# EAGLE design INFINITEAI-PCB (EAGLE 9.7.0)
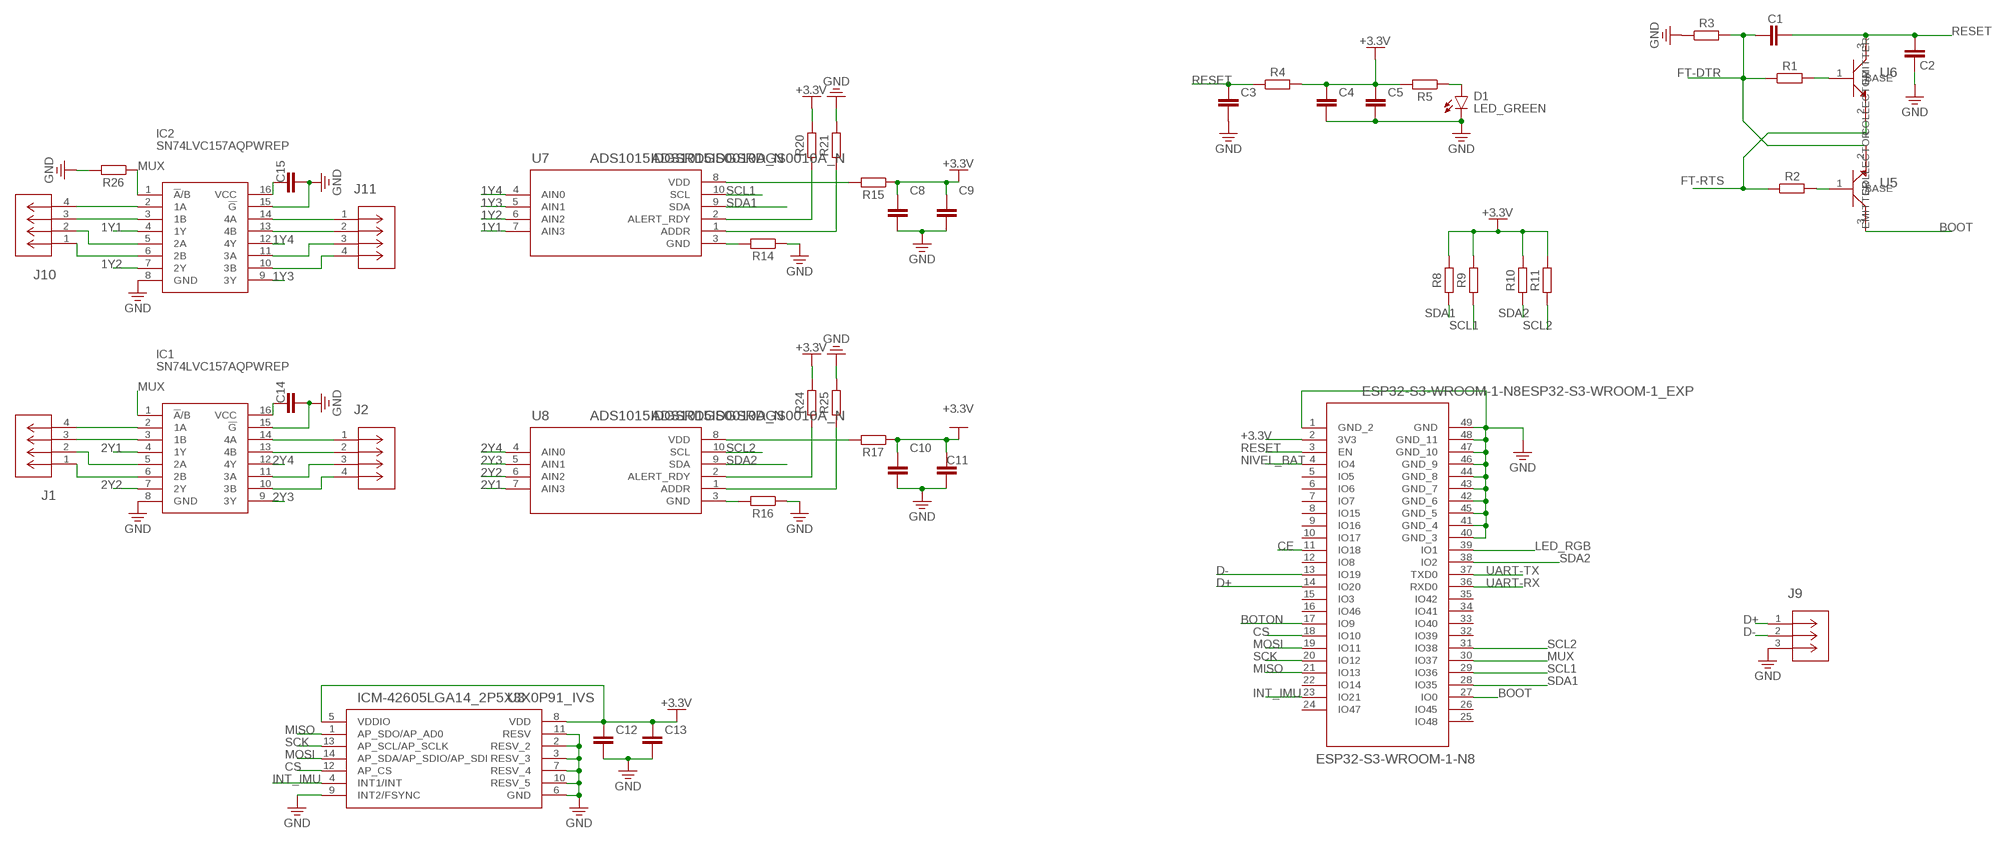
[diagram p0: schematic, sheet 1, part 1 of 2]
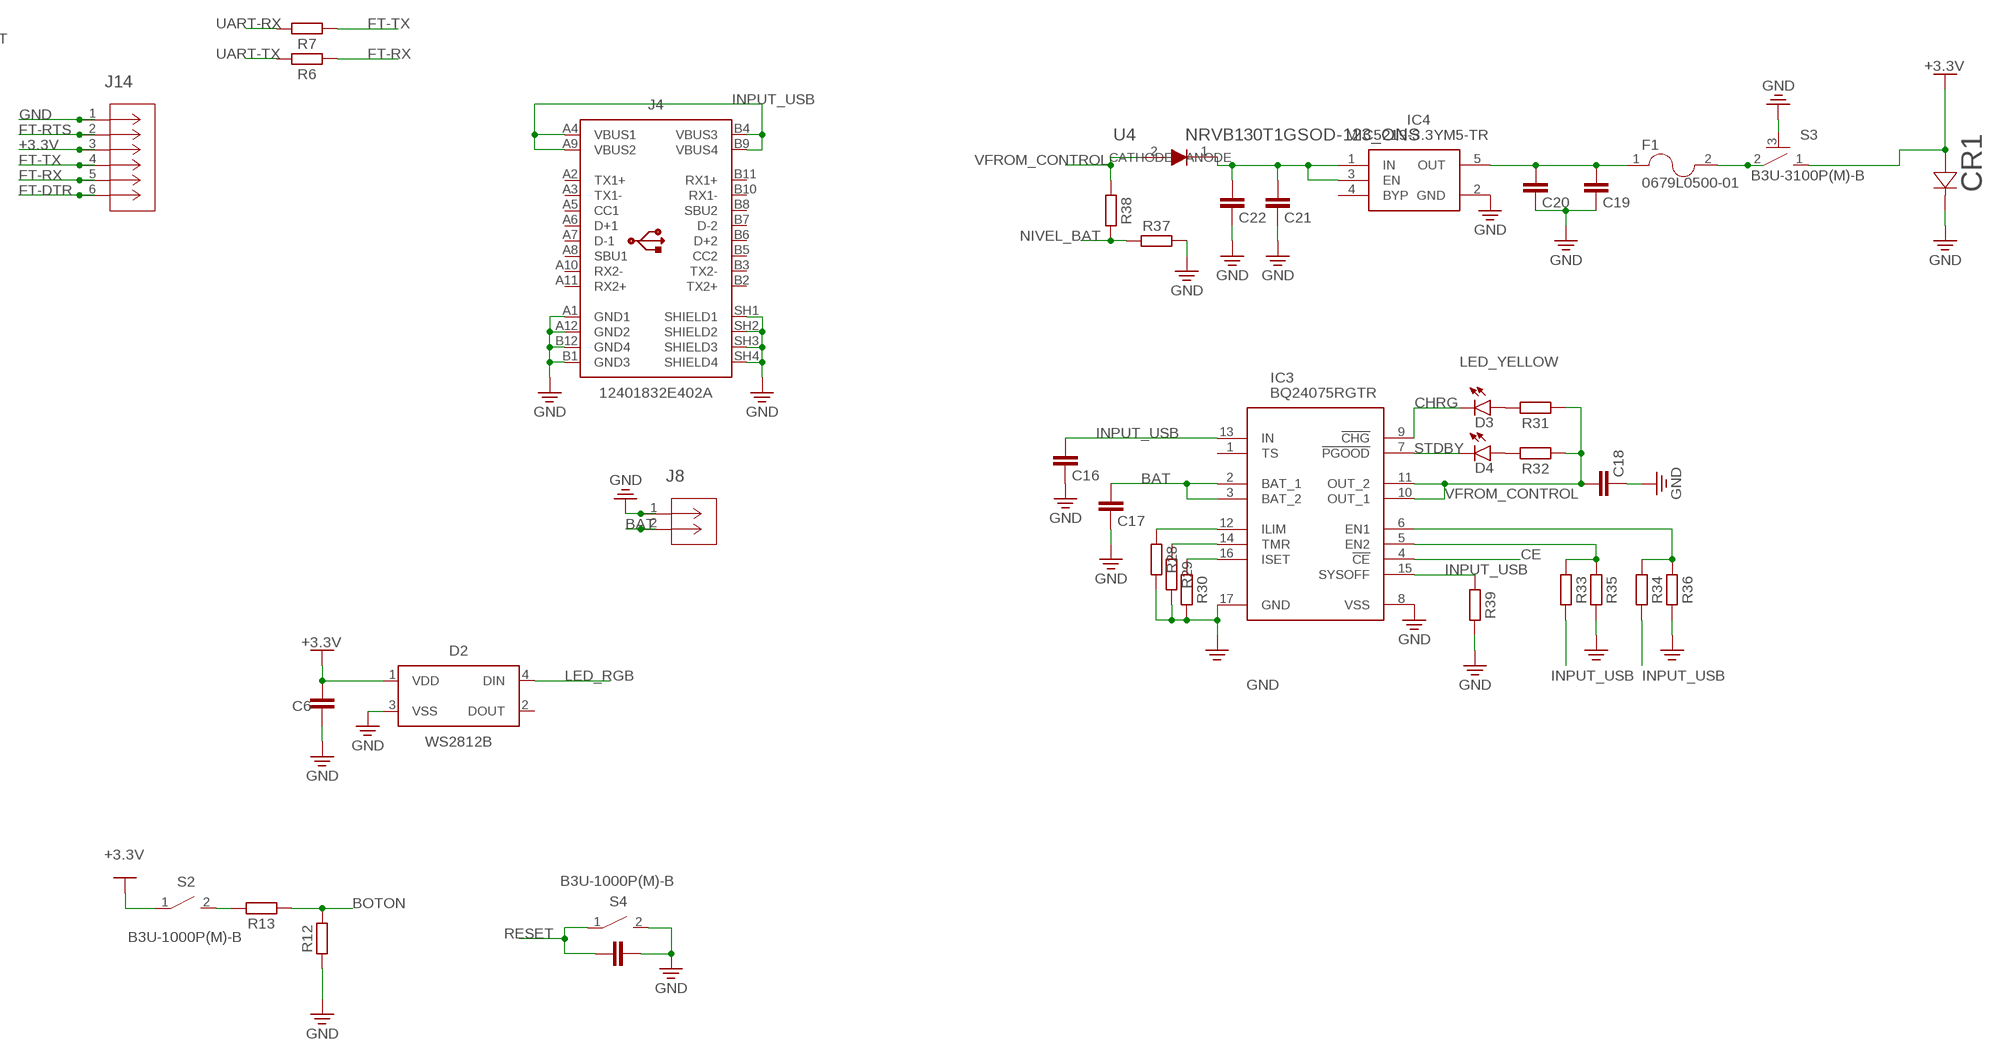
[diagram p1: schematic, sheet 1, part 2 of 2]

## Parts
C1  C_CHIP-0402(1005-METRIC)  [CAPC1005X60]
C2  C_CHIP-0402(1005-METRIC)  [CAPC1005X60]
C3  C_CHIP-0402(1005-METRIC)  [CAPC1005X60]
C4  C_CHIP-0402(1005-METRIC)  [CAPC1005X60]
C5  C_CHIP-0402(1005-METRIC)  [CAPC1005X60]
C6  C_CHIP-0402(1005-METRIC)  [CAPC1005X60]
C7  C_CHIP-0402(1005-METRIC)  [CAPC1005X60]
C8  C_CHIP-0402(1005-METRIC)  [CAPC1005X60]
C9  C_CHIP-0402(1005-METRIC)  [CAPC1005X60]
C10  C_CHIP-0402(1005-METRIC)  [CAPC1005X60]
C11  C_CHIP-0402(1005-METRIC)  [CAPC1005X60]
C12  C_CHIP-0402(1005-METRIC)  [CAPC1005X60]
C13  C_CHIP-0402(1005-METRIC)  [CAPC1005X60]
C14  C_CHIP-0402(1005-METRIC)  [CAPC1005X60]
C15  C_CHIP-0402(1005-METRIC)  [CAPC1005X60]
C16  C_CHIP-0402(1005-METRIC)  [CAPC1005X60]
C17  C_CHIP-0402(1005-METRIC)  [CAPC1005X60]
C18  C_CHIP-0402(1005-METRIC)  [CAPC1005X60]
C19  C_CHIP-0402(1005-METRIC)  [CAPC1005X60]
C20  C_CHIP-0402(1005-METRIC)  [CAPC1005X60]
C21  C_CHIP-0402(1005-METRIC)  [CAPC1005X60]
C22  C_CHIP-0402(1005-METRIC)  [CAPC1005X60]
CR1  BZT52C3V3-13SOD123_DIO  [SOD123_DIO]
D1  LED_GREEN  CHIP-FLAT-G_0402  [LEDC1005X25N_FLAT-G]
D2  WS2812B  [WS2812B]
D3  LED_YELLOW  CHIP-FLAT-Y_0402  [LEDC1005X25N_FLAT-Y]
D4  LED_YELLOW  CHIP-FLAT-Y_0402  [LEDC1005X25N_FLAT-Y]
ESP32-S3-WROOM-1-N8  ESP32-S3-WROOM-1-N8ESP32-S3-WROOM-1_EXP  [ESP32-S3-WROOM-1_EXP]
F1  0679L0500-01  [FUSC6125X279N]
IC1  SN74LVC157AQPWREP  [SOP65P640X120-16N]
IC2  SN74LVC157AQPWREP  [SOP65P640X120-16N]
IC3  BQ24075RGTR  [QFN50P300X300X100-17N]
IC4  MIC5219-3.3YM5-TR  [SOT95P280X145-5N]
J1  BM04B-SRSS-TBCONN4_BM04B-SRSS_JST  [CONN4_BM04B-SRSS_JST]
J2  BM04B-SRSS-TBCONN4_BM04B-SRSS_JST  [CONN4_BM04B-SRSS_JST]
J4  12401832E402A  [12401832E402A]
J8  B2B-ZR-SM4-TF(LF)(SN)CONN_B2B-ZR-SM4-TF_JST  [CONN_B2B-ZR-SM4-TF_JST]
J9  BM03B-SRSS-TB(LF)(SN)CONN_BM03B-SRSS-TB(LF)(SN)_JST  [CONN_BM03B-SRSS-TB(LF)(SN)_JST]
J10  BM04B-SRSS-TBCONN4_BM04B-SRSS_JST  [CONN4_BM04B-SRSS_JST]
J11  BM04B-SRSS-TBCONN4_BM04B-SRSS_JST  [CONN4_BM04B-SRSS_JST]
J14  BM06B-SRSS-TB(LF)(SN)CONN_BM06B-SRSS-TB_JST  [CONN_BM06B-SRSS-TB_JST]
R1  R_CHIP-0402(1005-METRIC)  [RESC1005X40]
R2  R_CHIP-0402(1005-METRIC)  [RESC1005X40]
R3  R_CHIP-0402(1005-METRIC)  [RESC1005X40]
R4  R_CHIP-0402(1005-METRIC)  [RESC1005X40]
R5  R_CHIP-0402(1005-METRIC)  [RESC1005X40]
R6  R_CHIP-0402(1005-METRIC)  [RESC1005X40]
R7  R_CHIP-0402(1005-METRIC)  [RESC1005X40]
R8  R_CHIP-0402(1005-METRIC)  [RESC1005X40]
R9  R_CHIP-0402(1005-METRIC)  [RESC1005X40]
R10  R_CHIP-0402(1005-METRIC)  [RESC1005X40]
R11  R_CHIP-0402(1005-METRIC)  [RESC1005X40]
R12  R_CHIP-0402(1005-METRIC)  [RESC1005X40]
R13  R_CHIP-0402(1005-METRIC)  [RESC1005X40]
R14  R_CHIP-0402(1005-METRIC)  [RESC1005X40]
R15  R_CHIP-0402(1005-METRIC)  [RESC1005X40]
R16  R_CHIP-0402(1005-METRIC)  [RESC1005X40]
R17  R_CHIP-0402(1005-METRIC)  [RESC1005X40]
R20  R_CHIP-0402(1005-METRIC)  [RESC1005X40]
R21  R_CHIP-0402(1005-METRIC)  [RESC1005X40]
R24  R_CHIP-0402(1005-METRIC)  [RESC1005X40]
R25  R_CHIP-0402(1005-METRIC)  [RESC1005X40]
R26  R_CHIP-0402(1005-METRIC)  [RESC1005X40]
R28  R_CHIP-0402(1005-METRIC)  [RESC1005X40]
R29  R_CHIP-0402(1005-METRIC)  [RESC1005X40]
R30  R_CHIP-0402(1005-METRIC)  [RESC1005X40]
R31  R_CHIP-0402(1005-METRIC)  [RESC1005X40]
R32  R_CHIP-0402(1005-METRIC)  [RESC1005X40]
R33  R_CHIP-0402(1005-METRIC)  [RESC1005X40]
R34  R_CHIP-0402(1005-METRIC)  [RESC1005X40]
R35  R_CHIP-0402(1005-METRIC)  [RESC1005X40]
R36  R_CHIP-0402(1005-METRIC)  [RESC1005X40]
R37  R_CHIP-0402(1005-METRIC)  [RESC1005X40]
R38  R_CHIP-0402(1005-METRIC)  [RESC1005X40]
R39  R_CHIP-0402(1005-METRIC)  [RESC1005X40]
S2  B3U-1000P(M)-B  B3U-X000B3U-1000P(M)-B1000P(M)-B  [B3U-1000P(M)-B]
S3  B3U-3100P(M)-B  B3U-X100B3U-3100P(M)-B3100P(M)-B  [B3U-3100P(M)-B]
S4  B3U-1000P(M)-B  B3U-X000B3U-1000P(M)-B1000P(M)-B  [B3U-1000P(M)-B]
U3  ICM-42605LGA14_2P5X3X0P91_IVS  [LGA14_2P5X3X0P91_IVS]
U4  NRVB130T1GSOD-123_ONS  [SOD-123_ONS]
U5  MMBT4401LT1GSOT-23_ONS  [SOT-23_ONS]
U6  MMBT4401LT1GSOT-23_ONS  [SOT-23_ONS]
U7  ADS1015IDGSRDGS0010A_N  [DGS0010A_N]
U8  ADS1015IDGSRDGS0010A_N  [DGS0010A_N]

## Nets
1Y1: IC2.4(1Y) U7.7(AIN3)
1Y2: IC2.7(2Y) U7.6(AIN2)
1Y3: IC2.9(3Y) U7.5(AIN1)
1Y4: IC2.12(4Y) U7.4(AIN0)
2Y1: IC1.4(1Y) U8.7(AIN3)
2Y2: IC1.7(2Y) U8.6(AIN2)
2Y3: IC1.9(3Y) U8.5(AIN1)
2Y4: IC1.12(4Y) U8.4(AIN0)
+3.3V: C4.1 C5.1 C6.1 C8.1 C9.1 C10.1 C11.1 C12.1 C13.1 CR1.2 D2.1(VDD) ESP32-S3-WROOM-1-N8.2(3V3) J14.3 R4.2 R5.2 R8.2 R9.2 R10.2 R11.2 R15.1 R17.1 R20.2 R24.2 S2.1 S3.1 U3.5(VDDIO) U3.8(VDD)
BAT: C17.1 IC3.2(BAT_1) IC3.3(BAT_2) J8.2
BOOT: ESP32-S3-WROOM-1-N8.27(IO0) U5.3(COLLECTOR)
BOTON: ESP32-S3-WROOM-1-N8.17(IO9) R12.2 R13.1
CE: ESP32-S3-WROOM-1-N8.11(IO18) IC3.4(!CE)
CHRG: D3.C IC3.9(!CHG)
CS: ESP32-S3-WROOM-1-N8.18(IO10) U3.12(AP_CS)
D+: ESP32-S3-WROOM-1-N8.14(IO20) J9.1
D-: ESP32-S3-WROOM-1-N8.13(IO19) J9.2
EN1: IC3.6(EN1) R34.1 R36.1
EN2: IC3.5(EN2) R33.1 R35.1
FT-DTR: C1.2 J14.6 R1.1 R3.2 U5.2(EMITTER)
FT-RTS: J14.2 R2.1 U6.2(EMITTER)
FT-RX: J14.5 R6.1
FT-TX: J14.4 R7.1
GND: C2.2 C3.2 C4.2 C5.2 C6.2 C7.2 C8.2 C9.2 C10.2 C11.2 C12.2 C13.2 C14.2 C15.2 C16.2 C17.2 C18.2 C19.2 C20.2 C21.2 C22.2 CR1.1 D1.C D2.3(VSS) ESP32-S3-WROOM-1-N8.1(GND_2) ESP32-S3-WROOM-1-N8.40(GND_3) ESP32-S3-WROOM-1-N8.41(GND_4) ESP32-S3-WROOM-1-N8.42(GND_6) ESP32-S3-WROOM-1-N8.43(GND_7) ESP32-S3-WROOM-1-N8.44(GND_8) ESP32-S3-WROOM-1-N8.45(GND_5) ESP32-S3-WROOM-1-N8.46(GND_9) ESP32-S3-WROOM-1-N8.47(GND_10) ESP32-S3-WROOM-1-N8.48(GND_11) ESP32-S3-WROOM-1-N8.49(GND) IC1.8(GND) IC1.15(!G) IC2.8(GND) IC2.15(!G) IC3.8(VSS) IC3.17(GND) IC4.2(GND) J4.A1(GND1) J4.A12(GND2) J4.B1(GND3) J4.B12(GND4) J4.SH1(SHIELD1) J4.SH2(SHIELD2) J4.SH3(SHIELD3) J4.SH4(SHIELD4) J8.1 J9.3 J14.1 R3.1 R12.1 R14.1 R16.1 R21.2 R25.2 R26.2 R28.2 R29.2 R30.2 R35.2 R36.2 R37.2 R39.2 S3.3 S4.2 U3.2(RESV_2) U3.3(RESV_3) U3.6(GND) U3.7(RESV_4) U3.9(INT2/FSYNC) U3.10(RESV_5) U3.11(RESV)
INPUT_USB: C16.1 IC3.13(IN) IC3.15(SYSOFF) J4.A4(VBUS1) J4.A9(VBUS2) J4.B4(VBUS3) J4.B9(VBUS4) R33.2 R34.2 R39.1
INT_IMU: ESP32-S3-WROOM-1-N8.23(IO21) U3.4(INT1/INT)
LED_RGB: D2.4(DIN) ESP32-S3-WROOM-1-N8.39(IO1)
MISO: ESP32-S3-WROOM-1-N8.21(IO13) U3.1(AP_SDO/AP_AD0)
MOSI: ESP32-S3-WROOM-1-N8.19(IO11) U3.14(AP_SDA/AP_SDIO/AP_SDI)
MUX: ESP32-S3-WROOM-1-N8.30(IO37) IC1.1(!A!/B) IC2.1(!A!/B) R26.1
N$1: R2.2 U5.1(BASE)
N$2: R1.2 U6.1(BASE)
N$3: C15.1 IC2.16(VCC)
N$4: IC2.3(1B) J10.3
N$5: D1.A R5.1
N$6: IC2.2(1A) J10.4
N$7: C21.1 C22.1 IC4.1(IN) IC4.3(EN) U4.1(CATHODE)
N$8: R13.2 S2.2
N$9: IC2.5(2A) J10.2
N$10: R20.1 U7.2(ALERT_RDY)
N$11: IC2.6(2B) J10.1
N$12: R14.2 U7.3(GND)
N$13: R15.2 U7.8(VDD)
N$14: IC2.11(3A) J11.3
N$15: IC2.14(4A) J11.1
N$16: R24.1 U8.2(ALERT_RDY)
N$17: IC2.13(4B) J11.2
N$18: R16.2 U8.3(GND)
N$19: R17.2 U8.8(VDD)
N$20: IC2.10(3B) J11.4
N$21: C19.1 C20.1 F1.1 IC4.5(OUT)
N$22: IC3.12(ILIM) R28.1
N$23: C14.1 IC1.16(VCC)
N$24: IC1.5(2A) J1.2
N$25: IC1.6(2B) J1.1
N$26: IC1.14(4A) J2.1
N$27: IC1.11(3A) J2.3
N$28: IC3.14(TMR) R29.1
N$29: IC1.3(1B) J1.3
N$30: IC1.2(1A) J1.4
N$31: IC1.13(4B) J2.2
N$32: IC1.10(3B) J2.4
N$33: IC3.16(ISET) R30.1
N$34: D3.A R31.2
N$35: D4.A R32.2
N$36: F1.2 S3.2
N$37: R21.1 U7.1(ADDR)
N$38: R25.1 U8.1(ADDR)
NIVEL_BAT: ESP32-S3-WROOM-1-N8.4(IO4) R37.1 R38.2
RESET: C1.1 C2.1 C3.1 C7.1 ESP32-S3-WROOM-1-N8.3(EN) R4.1 S4.1 U6.3(COLLECTOR)
SCK: ESP32-S3-WROOM-1-N8.20(IO12) U3.13(AP_SCL/AP_SCLK)
SCL1: ESP32-S3-WROOM-1-N8.29(IO36) R9.1 U7.10(SCL)
SCL2: ESP32-S3-WROOM-1-N8.31(IO38) R11.1 U8.10(SCL)
SDA1: ESP32-S3-WROOM-1-N8.28(IO35) R8.1 U7.9(SDA)
SDA2: ESP32-S3-WROOM-1-N8.38(IO2) R10.1 U8.9(SDA)
STDBY: D4.C IC3.7(!PGOOD)
UART-RX: ESP32-S3-WROOM-1-N8.36(RXD0) R7.2
UART-TX: ESP32-S3-WROOM-1-N8.37(TXD0) R6.2
VFROM_CONTROL: C18.1 IC3.10(OUT_1) IC3.11(OUT_2) R31.1 R32.1 R38.1 U4.2(ANODE)
Unconnected: D2.2(DOUT) ESP32-S3-WROOM-1-N8.5(IO5) ESP32-S3-WROOM-1-N8.6(IO6) ESP32-S3-WROOM-1-N8.7(IO7) ESP32-S3-WROOM-1-N8.8(IO15) ESP32-S3-WROOM-1-N8.9(IO16) ESP32-S3-WROOM-1-N8.10(IO17) ESP32-S3-WROOM-1-N8.12(IO8) ESP32-S3-WROOM-1-N8.15(IO3) ESP32-S3-WROOM-1-N8.16(IO46) ESP32-S3-WROOM-1-N8.22(IO14) ESP32-S3-WROOM-1-N8.24(IO47) ESP32-S3-WROOM-1-N8.25(IO48) ESP32-S3-WROOM-1-N8.26(IO45) ESP32-S3-WROOM-1-N8.32(IO39) ESP32-S3-WROOM-1-N8.33(IO40) ESP32-S3-WROOM-1-N8.34(IO41) ESP32-S3-WROOM-1-N8.35(IO42) IC3.1(TS) IC4.4(BYP) J4.A2(TX1+) J4.A3(TX1-) J4.A5(CC1) J4.A6(D+1) J4.A7(D-1) J4.A8(SBU1) J4.A10(RX2-) J4.A11(RX2+) J4.B2(TX2+) J4.B3(TX2-) J4.B5(CC2) J4.B6(D+2) J4.B7(D-2) J4.B8(SBU2) J4.B10(RX1-) J4.B11(RX1+)

## Library data of the parts
C1-C22 = Capacitor:C: Capacitor - Generic; CATEGORY: Capacitor
CR1 = Zener: BZT52C3V3:BZT52C3V3-13; COPYRIGHT: Copyright (C) 2024 Ultra Librarian. All rights reserved.; MANUFACTURER_PART_NUMBER: BZT52C3V3-13; MFR_NAME: Diodes Inc
D1 = LED:CHIP-FLAT-G; CATEGORY: LED; COLOR: GREEN; DESCRIPTION: CHIP LED FLAT; SUB-CATEGORY: CHIP; TYPE: FLAT_TOP
D2 = LED:WS2812B: Intelligent control LED integrated light source Datasheet; CATEGORY: LED; COLOR: RGB; DESCRIPTION: LED integrated light source; MANUFACTURER: Worldsemi; MPN: WS2812B; OPERATING_TEMP: -25 ℃ to +80℃(TJ); PART_STATUS: Active; SUB_CATEGORY: RGB
D3 D4 = LED:CHIP-FLAT-Y; CATEGORY: LED; COLOR: YELLOW; DESCRIPTION: CHIP LED FLAT; SUB-CATEGORY: CHIP; TYPE: FLAT_TOP
ESP32-S3-WROOM-1-N8 = ESP32-S3-WROOM-1-N8:ESP32-S3-WROOM-1-N8; COPYRIGHT: Copyright (C) 2024 Ultra Librarian. All rights reserved.; MANUFACTURER_PART_NUMBER: ESP32-S3-WROOM-1-N8; MFR_NAME: Espressif Systems; TYPE: Transceiver module
F1 = 0679L0500-01:0679L0500-01: 2410 SMT Fuse | Quick Acting | 250mA | Higher AC Voltage; MANUFACTURER: BELFUSE; MAXIMUM_PACKAGE_HEIGHT: 2.79mm; PARTREV: 0679H Apr2019; STANDARD: IPC-7351B
IC1 IC2 = SN74LVCXXX:SN74LVC157AQPWREP: Enhanced Product Quadruple 2-Line To 1-Line Data Selector / Multiplexer Source: Datasheet; DESCRIPTION: Enhanced Product Quadruple 2-Line To 1-Line Data Selector / Multiplexer; HEIGHT: 1.2mm; MANUFACTURER_NAME: Texas Instruments; MANUFACTURER_PART_NUMBER: SN74LVC157AQPWREP; MOUSER_PART_NUMBER: 595-N74LVC157AQPWREP; MOUSER_PRICE-STOCK: https://www.mouser.co.uk/ProductDetail/Texas-Instruments/SN74LVC157AQPWREP?qs=7reVrgTiN3aADQ%2FoXWttvw%3D%3D
IC3 = BQ24075RGTR:BQ24075RGTR: USB-Friendly Li-Ion Battery Charger and Power-Path Management IC, Vout 5.5V Source: Datasheet; DESCRIPTION: USB-Friendly Li-Ion Battery Charger and Power-Path Management IC, Vout 5.5V; HEIGHT: 1mm; MANUFACTURER_NAME: Texas Instruments; MANUFACTURER_PART_NUMBER: BQ24075RGTR; MOUSER_PART_NUMBER: 595-BQ24075RGTR; MOUSER_PRICE-STOCK: https://www.mouser.co.uk/ProductDetail/Texas-Instruments/BQ24075RGTR?qs=XGzIaZb%2FFYKTADIJv746hA%3D%3D
IC4 = MIC5219-3.3YM5-TR:MIC5219-3.3YM5-TR: LDO Regulator Pos 3.3V 0.5A Microchip MIC5219-3.3YM5-TR, LDO Voltage Regulator, 500mA, 3.3 V +/-2%, 2.5 12 Vin, 5-Pin SOT-23 Source: Datasheet; DESCRIPTION: LDO Regulator Pos 3.3V 0.5A Microchip MIC5219-3.3YM5-TR, LDO Voltage Regulator, 500mA, 3.3 V +/-2%, 2.5 12 Vin, 5-Pin SOT-23; HEIGHT: 1.45mm; MANUFACTURER_NAME: Microchip; MANUFACTURER_PART_NUMBER: MIC5219-3.3YM5-TR; MOUSER_PART_NUMBER: 998-MIC5219-3.3YM5TR; MOUSER_PRICE-STOCK: https://www.mouser.co.uk/ProductDetail/Microchip-Technology/MIC5219-3.3YM5-TR?qs=U6T8BxXiZAWojkIJMtSJlw%3D%3D
J1 J2 J10 J11 = JST4:BM04B-SRSS-TB; COPYRIGHT: Copyright (C) 2024 Ultra Librarian. All rights reserved.; MANUFACTURER_PART_NUMBER: BM04B-SRSS-TB; MFR_NAME: JST; TYPE: Headers, Male Pins
J4 = Connector_USB:12401832E402A: USB(3.1) Type-C, RCPT, 24POS, SMD-THT-R/A Datasheet <https://cdn.amphenol-icc.com/media/wysiwyg/files/documentation/datasheet/inputoutput/io_usb_type_c.pdf> Drawing <https://cdn.amphenol-icc.com/media/wysiwyg/files/drawing/c12401832e402a.pdf>; CATEGORY: Connector; CONTACTS: 24; CURRENT_RATING: 5A; DESCRIPTION: CONN RCP USB3.1 TYPEC 24P SMD RA; GENDER: Receptacle; MANUFACTURER: Amphenol ICC; MOUNT_TYPE: R/A; MPN: 12401832E402A; PART_STATUS: Active; ROHS_COMPLIANT: COMPLIANT; SUB-CATEGORY: USB; TYPE: USB-C
J8 = JST 2 BAT:B2B-ZR-SM4-TF(LF)(SN); COPYRIGHT: Copyright (C) 2024 Ultra Librarian. All rights reserved.; MANUFACTURER_PART_NUMBER: B2B-ZR-SM4-TF(LF)(SN); MFR_NAME: JST
J9 = JST 3:BM03B-SRSS-TB(LF)(SN); COPYRIGHT: Copyright (C) 2024 Ultra Librarian. All rights reserved.; MANUFACTURER_PART_NUMBER: BM03B-SRSS-TB(LF)(SN); MFR_NAME: JST
J14 = JST-6:BM06B-SRSS-TB(LF)(SN); COPYRIGHT: Copyright (C) 2024 Ultra Librarian. All rights reserved.; MANUFACTURER_PART_NUMBER: BM06B-SRSS-TB(LF)(SN); MFR_NAME: JST
R1-R17 R20 R21 R24-R26 R28-R39 = Resistor:R: Resistor Fixed - Generic; CATEGORY: Resistor; SUB-CATEGORY: Fixed
S2 S4 = Switch:B3U-X000: Ultra-small Tactile Switch Contact form : SPST-NO Datasheet; CATEGORY: SWITCH; DESCRIPTION: Ultra-small Surface-mounting Tactile Switches with High Contact Reliability; MANUFACTURER: OMRON; OPERATING_TEMPERATURE: -25°C to +70°C at 60%RH max; PART_STATUS: ACTIVE; SERIES: B3U; TYPE: Tactile
S3 = Switch:B3U-X100: Ultra-small Tactile Switch Contact form : SPST-NO Datasheet; CATEGORY: SWITCH; DESCRIPTION: Ultra-small Surface-mounting Tactile Switches with High Contact Reliability; MAUFACTURER: OMRON; OPERATING_TEMP: -25°C to +70°C at 60%RH max; PART_STATUS: ACTIVE; ROHS_COMPLIANCE: RoHS Compliant; SERIES: B3U; TYPE: Tactile
U3 = ICM42605:ICM-42605; COPYRIGHT: Copyright (C) 2024 Ultra Librarian. All rights reserved.; MANUFACTURER_PART_NUMBER: ICM-42605; MFR_NAME: InvenSense
U4 = NRVB130T1G:NRVB130T1G; COPYRIGHT: Copyright (C) 2024 Ultra Librarian. All rights reserved.; MANUFACTURER_PART_NUMBER: NRVB130T1G; MFR_NAME: onsemi
U5 U6 = SOT-23_ONS:MMBT4401LT1G; COPYRIGHT: Copyright (C) 2024 Ultra Librarian. All rights reserved.; MANUFACTURER_PART_NUMBER: MMBT4401LT1G; MFR_NAME: onsemi
U7 U8 = ADS1015:ADS1015IDGSR; COPYRIGHT: Copyright (C) 2024 Ultra Librarian. All rights reserved.; MANUFACTURER_PART_NUMBER: ADS1015IDGSR; MFR_NAME: Texas Instruments; REFDES: RefDes; TYPE: TYPE

## Board
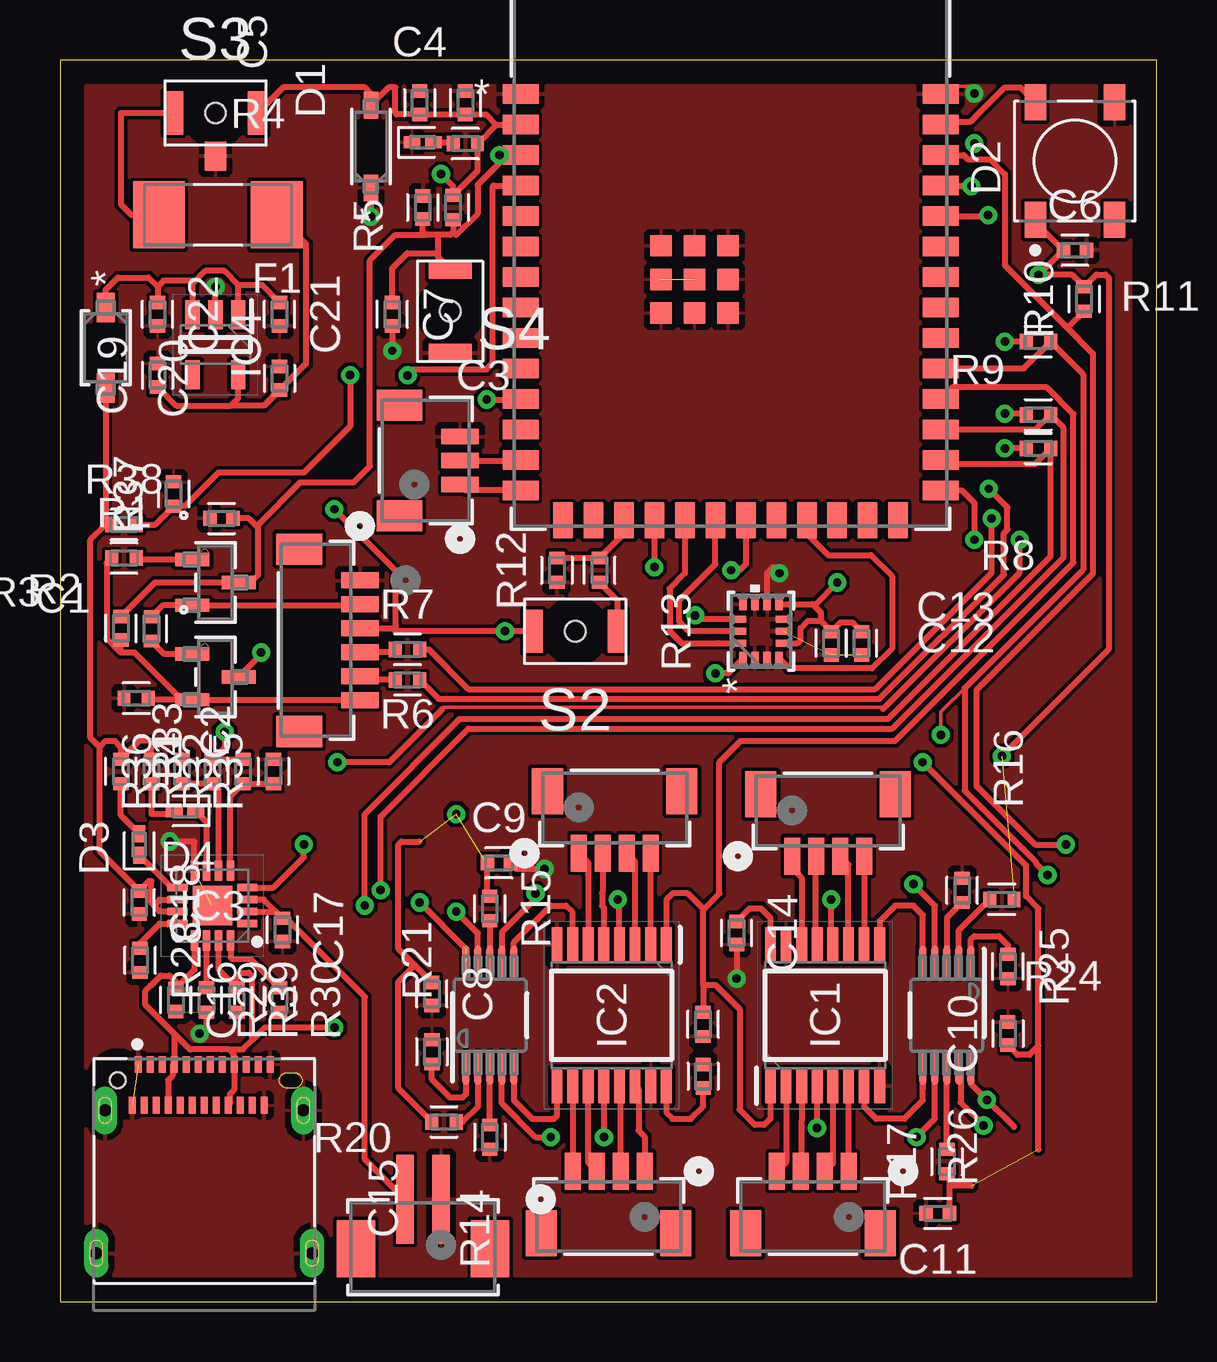
[diagram p2: board, top side]
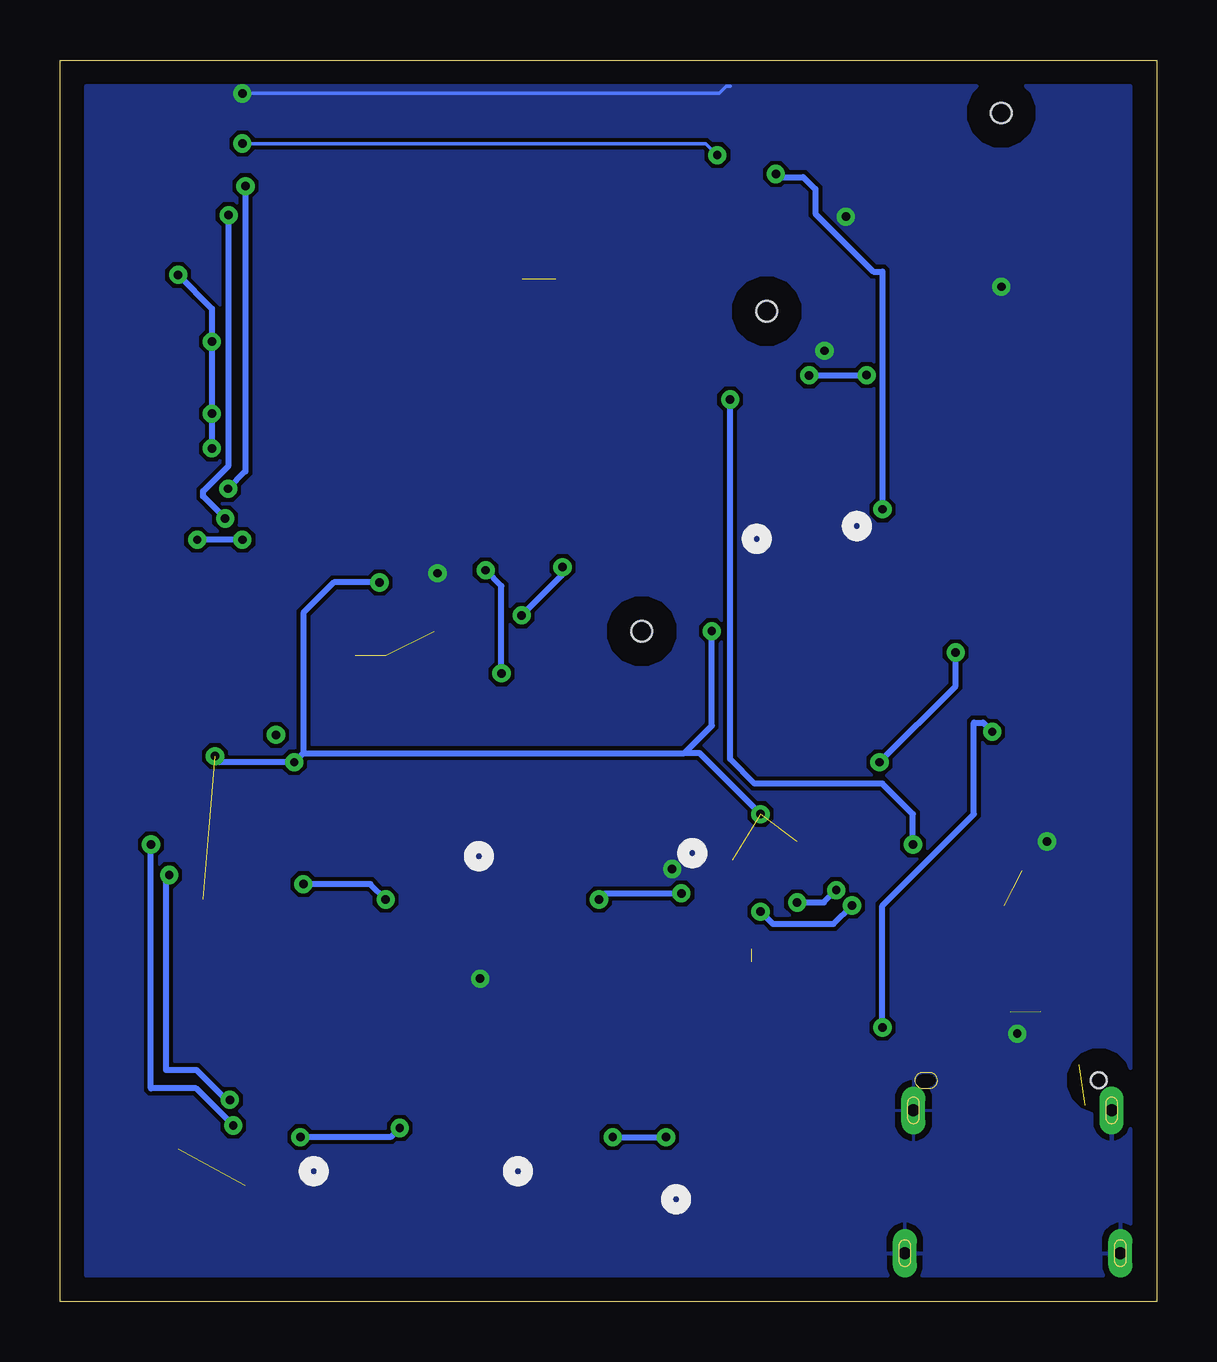
[diagram p3: board, bottom side, seen from below]

Size 45.7 x 51.74 mm. Coordinates in mm from the lower left corner, seen from the top.
Outline: 0,0 45.7,0 45.7,51.74 0,51.74 0,0
Copper layers (1*16): Top / Bottom
Stack-up Default Layer Stack: Top User Defined 0.035mm / Dielectric-1 User Defined 1.5mm / Bottom User Defined 0.035mm
Design rules: minimum copper width 6mil, minimum drill size 0.35mm, copper clearance wire_polygon to wire_polygon 6mil, copper clearance wire_polygon to pad_smd 6mil, copper clearance wire_polygon to via 6mil, copper clearance pad_smd to pad_smd 6mil, copper clearance pad_smd to via 6mil, copper clearance via to via 6mil, copper clearance smd to pad (same net) 6mil, copper clearance smd to via (same net) 6mil, copper clearance smd to smd (same net) 6mil, dimension clearance 40mil, via restrict clearance 0mil, restrict clearance 0mil, drill distance 6mil, keepout clearance 0mil

### Footprints (pad centres in the part's own frame; a part is rotated, then mirrored left to right if it is on the bottom)
CAPC1005X60 = smd 0.56 x 0.629: 1 -0.485,0; 2 0.485,0
SOD123_DIO = smd 1.111 x 0.601: 1 -1.725,0; 2 1.725,0
LEDC1005X25N_FLAT-G = smd 0.7 x 0.5: A 0.45,0; C -0.45,0
WS2812B = smd 1.5 x 0.9: 1 -2.45,1.65; 2 -2.45,-1.65; 3 2.45,-1.65; 4 2.45,1.65
LEDC1005X25N_FLAT-Y = smd 0.7 x 0.5: A 0.45,0; C -0.45,0
ESP32-S3-WROOM-1_EXP = smd 1.499 x 0.813: 1 -8.75,5.26; 2 -8.75,3.99; 3 -8.75,2.72; 4 -8.75,1.45; 5 -8.75,0.18; 6 -8.75,-1.09; 7 -8.75,-2.36; 8 -8.75,-3.63; 9 -8.75,-4.9; 10 -8.75,-6.17; 11 -8.75,-7.44; 12 -8.75,-8.71; 13 -8.75,-9.98; 14 -8.75,-11.25; 27 8.75,-11.25; 28 8.75,-9.98; 29 8.75,-8.71; 30 8.75,-7.44; 31 8.75,-6.17; 32 8.75,-4.9; 33 8.75,-3.63; 34 8.75,-2.36; 35 8.75,-1.09; 36 8.75,0.18; 37 8.75,1.45; 38 8.75,2.72; 39 8.75,3.99; 40 8.75,5.26 | smd 0.813 x 1.499: 15 -6.985,-12.5; 16 -5.715,-12.5; 17 -4.445,-12.5; 18 -3.175,-12.5; 19 -1.905,-12.5; 20 -0.635,-12.5; 21 0.635,-12.5; 22 1.905,-12.5; 23 3.175,-12.5; 24 4.445,-12.5; 25 5.715,-12.5; 26 6.985,-12.5 | smd 0.889 x 0.889: 41 -1.5,-2.46; 42 -2.9,-1.06; 43 -2.9,-2.46; 44 -2.9,-3.86; 45 -1.5,-3.86; 46 -0.1,-3.86; 47 -0.1,-2.46; 48 -0.1,-1.06; 49 -1.5,-1.06
FUSC6125X279N = smd 2.15 x 2.8: 1 -2.455,0; 2 2.455,0
SOP65P640X120-16N = smd 1.475 x 0.45: 1 -2.938,2.275; 2 -2.938,1.625; 3 -2.938,0.975; 4 -2.938,0.325; 5 -2.938,-0.325; 6 -2.938,-0.975; 7 -2.938,-1.625; 8 -2.938,-2.275; 9 2.938,-2.275; 10 2.938,-1.625; 11 2.938,-0.975; 12 2.938,-0.325; 13 2.938,0.325; 14 2.938,0.975; 15 2.938,1.625; 16 2.938,2.275
QFN50P300X300X100-17N = smd 0.85 x 0.3: 1 -1.45,0.75; 2 -1.45,0.25; 3 -1.45,-0.25; 4 -1.45,-0.75; 9 1.45,-0.75; 10 1.45,-0.25; 11 1.45,0.25; 12 1.45,0.75 | smd 0.3 x 0.85: 5 -0.75,-1.45; 6 -0.25,-1.45; 7 0.25,-1.45; 8 0.75,-1.45; 13 0.75,1.45; 14 0.25,1.45; 15 -0.25,1.45; 16 -0.75,1.45 | smd 1.65 x 1.65: 17 0,0
SOT95P280X145-5N = smd 1.2 x 0.6: 1 -1.25,0.95; 2 -1.25,0; 3 -1.25,-0.95; 4 1.25,-0.95; 5 1.25,0.95
CONN4_BM04B-SRSS_JST = smd 0.66 x 1.549: 1 -1.5,-1.882; 2 -0.5,-1.882; 3 0.5,-1.882; 4 1.5,-1.882 | smd 1.295 x 1.905: 5 -2.8,0.698; 6 2.8,0.698
12401832E402A = smd 0.3 x 0.7: A1 -2.75,5; A2 -2.25,5; A3 -1.75,5; A4 -1.25,5; A5 -0.75,5; A6 -0.25,5; A7 0.25,5; A8 0.75,5; A9 1.25,5; A10 1.75,5; A11 2.25,5; A12 2.75,5; B1 2.5,3.3; B2 2,3.3; B3 1.5,3.3; B4 1,3.3; B5 0.5,3.3; B6 0,3.3; B7 -0.5,3.3; B8 -1,3.3; B9 -1.5,3.3; B10 -2,3.3; B11 -2.5,3.3; B12 -3,3.3 | drill 0.5 pad 0.8 long: SH1 -4.13,3.09; SH2 4.13,3.09; SH3 4.49,-2.86; SH4 -4.49,-2.86 | hole 0.65: -3.6,4.34
CONN_B2B-ZR-SM4-TF_JST = smd 0.711 x 3.708: 1 0,0; 2 1.5,0 | smd 1.6 x 2.388: 3 -2.05,2.061; 4 3.55,2.061
CONN_BM03B-SRSS-TB(LF)(SN)_JST = smd 0.66 x 1.549: 1 1,1.428; 2 0,1.428; 3 -1,1.428 | smd 1.295 x 1.905: 4 -2.3,-1.097; 5 2.3,-1.097
CONN_BM06B-SRSS-TB_JST = smd 0.66 x 1.549: 1 -2.5,1.83; 2 -1.5,1.83; 3 -0.5,1.83; 4 0.5,1.83; 5 1.5,1.83; 6 2.5,1.83 | smd 1.295 x 1.905: 7 -3.8,-0.695; 8 3.8,-0.695
RESC1005X40 = smd 0.535 x 0.644: 1 -0.507,0; 2 0.507,0
B3U-1000P(M)-B = smd 0.8 x 1.8: 1 -1.75,0; 2 1.75,0 | hole 0.85: 0,0
B3U-3100P(M)-B = smd 0.8 x 1.8: 1 1.75,0; 2 -1.75,0 | smd 0.9 x 1.2: 3 0,-1.8 | hole 0.85: 0,0
LGA14_2P5X3X0P91_IVS = smd 0.533 x 0.305: 1 -1.13,0.75; 2 -1.13,0.25; 3 -1.13,-0.25; 4 -1.13,-0.75; 8 1.13,-0.75; 9 1.13,-0.25; 10 1.13,0.25; 11 1.13,0.75 | smd 0.305 x 0.533: 5 -0.5,-0.889; 6 0,-0.889; 7 0.5,-0.889; 12 0.5,0.889; 13 0,0.889; 14 -0.5,0.889
SOD-123_ONS = smd 1.219 x 0.762: 1 -1.676,0; 2 1.676,0
SOT-23_ONS = smd 0.559 x 1.422: 1 -0.953,-0.965; 2 0.953,-0.965; 3 0,0.965
DGS0010A_N = smd 1.35 x 0.3: 1 -2.225,1; 2 -2.225,0.5; 3 -2.225,0; 4 -2.225,-0.5; 5 -2.225,-1; 6 2.225,-1; 7 2.225,-0.5; 8 2.225,0; 9 2.225,0.5; 10 2.225,1

### Placement (x,y rotation side)
C1  2.54,28.07 270 top
C2  6.73,32.64 180 top
C3  15.11,45.59 90 top
C4  16.89,49.96 90 top
C5  14.99,49.96 90 top
C6  42.29,43.82 0 top
C7  13.84,41.15 270 top
C8  15.49,12.83 270 top
C9  18.29,18.29 0 top
C10  39.5,11.18 90 top
C11  36.58,3.68 180 top
C12  32.13,27.43 270 top
C13  33.4,27.43 270 top
C14  28.19,15.37 270 top
C15  26.8,9.4 90 top
C16  4.83,12.57 270 top
C17  9.27,15.49 270 top
C18  3.3,16.64 270 top
C19  4.06,38.61 90 top
C20  9.14,38.48 90 top
C21  9.14,41.15 270 top
C22  4.06,41.15 270 top
CR1  12.95,48.13 90 top
D1  15.11,48.32 0 top
D2  42.29,47.52 90 top
D3  3.3,19.05 90 top
D4  5.21,20.45 180 top
ESP32-S3-WROOM-1-N8  27.94,45.06 0 top
F1  6.58,45.29 180 top
IC1  31.88,11.94 90 top
IC2  22.99,11.94 270 top
IC3  6.35,16.51 180 top
IC4  6.48,39.88 270 top
J1  31.37,3.56 180 top
J2  32,20.45 0 top
J4  6.01,4.88 0 top
J8  15.87,4.27 180 top
J9  15.24,35.05 270 top
J10  23.11,20.57 0 top
J11  22.86,3.56 180 top
J14  10.67,27.56 270 top
R1  2.67,30.99 0 top
R2  3.81,28.04 270 top
R3  3.17,25.15 0 top
R4  16.38,45.59 90 top
R5  16.89,48.26 0 top
R6  14.48,25.91 0 top
R7  14.48,27.18 0 top
R8  40.77,35.56 180 top
R9  40.77,36.96 180 top
R10  42.67,41.78 90 top
R11  40.77,40.01 180 top
R12  20.7,30.48 90 top
R13  22.48,30.48 270 top
R14  17.91,6.86 90 top
R15  17.91,16.38 270 top
R16  37.59,17.15 270 top
R17  36.96,5.84 90 top
R20  16,7.49 180 top
R21  15.49,10.41 90 top
R24  39.24,16.76 0 top
R25  39.5,13.97 270 top
R26  26.8,11.56 270 top
R28  3.34,14.22 270 top
R29  6.1,12.57 270 top
R30  9.14,12.57 270 top
R31  2.54,22.1 270 top
R32  3.81,22.1 270 top
R33  7.62,22.1 90 top
R34  6.35,22.1 90 top
R35  8.89,22.1 90 top
R36  5.08,22.1 90 top
R37  4.73,33.66 90 top
R38  2.67,32.38 0 top
R39  7.37,12.57 270 top
S2  21.46,27.94 0 top
S3  6.48,49.53 0 top
S4  16.26,41.27 270 top
U3  29.21,27.94 90 top
U4  1.91,39.75 270 top
U5  6.48,26.04 270 top
U6  6.48,29.97 270 top
U7  17.91,11.94 90 top
U8  36.96,11.94 270 top

### Tracks (layer width: path | path; a pad name or v marks a point on that pad's centre or on a via)
1Y1  (via drill 0.35)
  Top 0.254: IC2.4 23.31,16.69 v23.24,16.76 | U7.7 18.41,15.39 19.81,16.8 v19.81,17.02
  Bottom 0.254: v23.24,16.76 22.99,17.02 v19.81,17.02
1Y2
  Top 0.254: IC2.7 21.34,14.9 21.34,16.26 21.08,16.51 20.45,16.51 18.91,14.97 U7.6
1Y3
  Top 0.254: IC2.9 20.71,7.76 20.57,7.62 19.68,7.62 18.91,8.4 U7.5
1Y4  (via drill 0.35)
  Top 0.254: v22.67,6.86 v22.66,6.87 IC2.12 | U7.4 18.41,8.26 19.81,6.86 v20.45,6.86
  Bottom 0.254: v22.67,6.86 v20.45,6.86
2Y1  (via drill 0.35)
  Top 0.254: IC1.4 31.55,7.25 v31.54,7.24 | U8.7 36.46,7.63 v35.69,6.86
  Bottom 0.254: v31.54,7.24 31.93,6.86 v35.69,6.86
2Y2
  Top 0.254: 35.96,8.9 U8.6 35.96,8.4 35.18,7.62 34.01,7.62 33.5,8.13 IC1.7
2Y3
  Top 0.254: IC1.9 34.15,15.86 34.8,16.51 35.56,16.51 35.96,16.11 U8.5
2Y4  (via drill 0.35)
  Top 0.254: IC1.12 32.13,14.95 v32.13,16.76 | U8.4 36.46,16.5 v35.56,17.4
  Bottom 0.254: v32.13,16.76 32.77,17.4 v35.56,17.4
+3.3V  (via drill 0.35)  (4 unrouted)
  Top 0.254: U3.5 30.74,27.44 30.86,27.56 30.86,28.07 31.16,28.37 31.7,28.37 | U3.8 31.36,29.07 | C13.1 33.01,28.31 32.52,28.31 C12.1 32.13,27.94 31.7,28.37 | 31.36,29.07 31.7,28.73 31.7,28.37 | R5.2 18.19,49.05 | 18.19,49.05 ESP32-S3-WROOM-1-N8.2 | 18.19,49.05 17.76,49.48 C4.1 C5.1 14.02,49.48 13.97,49.53 13.97,50.6 13.69,50.6 CR1.2 12.95,50.34 12.7,50.6 9.29,50.6 S3.1 | 17.78,18.29 C9.1 | R15.1 17.8,16.99 C9.1 | 17.68,18.41 C9.1 | C8.1 14.78,14.02 | 14.78,14.02 14.1,14.71 14.1,19.05 14.22,19.18 14.99,19.18 | R20.2 14.1,8.89 14.1,13.34 14.78,14.02 | 40.77,10.67 40.77,16.38 40.26,16.89 40.26,18.16 v35.94,22.48 | 40.77,10.67 40.39,10.29 39.9,10.29 C10.1 | R17.1 37.06,5.23 37.06,4.83 | 37.06,4.83 C11.1 | 37.97,4.83 37.06,4.83 | 40.77,6.35 40.77,10.67 | D2.1 40.64,44.98 C6.1 v40.78,42.79 42.18,42.79 R10.2 43.18,42.8 43.56,42.8 43.69,42.67 43.69,27.18 v39.24,22.73 | R11.2 v39.37,40.01 | R8.2 v39.37,35.56 | R9.2 40.21,37 v39.37,37 v39.37,37.01 | 19.59,28.06 S2.1 v18.54,27.94 13.97,27.94 | 31.36,29.07 31.48,29.07 v32.38,29.97 | v11.43,33.02 13.97,30.48 13.97,27.94 | J14.3 13.85,28.06 13.97,27.94 | 15.91,47.02 v15.87,46.99 16.38,46.48 R4.2 17.4,47.12 R5.2 | R5.2 17.37,48.26
  Bottom 0.254: v39.37,35.56 v39.37,37.01 v39.37,40.01 39.37,41.38 v40.78,42.79 | v32.38,29.97 34.29,29.97 35.56,28.7 35.56,22.86 | 35.56,22.86 19.68,22.86 | 19.68,22.86 18.54,24 v18.54,27.94 | v16.51,20.32 19.05,22.86 19.68,22.86 | 35.56,22.86 v35.94,22.48 39.24,22.48 v39.24,22.73 | v11.43,33.02 11.43,42.93 11.81,42.93 14.22,45.34 14.22,46.35 14.73,46.86 15.75,46.86 v15.87,46.99
BAT
  Top 0.254: IC3.2 8.99,16.26 C17.1 | C17.1 8.49,16.76 IC3.3 | J8.2 12.7,5.95 12.7,12.7 9.42,15.98 C17.1
BOOT  (via drill 0.35)
  Top 0.152: 15.3,24.07 16,24.77 34.21,24.77 34.29,24.69
  Top 0.254: U5.3 8.38,26.98 v8.38,27.05 | ESP32-S3-WROOM-1-N8.27 37.58,33.81 38.1,33.29 v38.1,31.75 | 15.93,24.69 15.3,24.07 13.72,22.48 v11.56,22.48 | 34.29,24.69 39.98,30.38 v39.98,31.75
  Bottom 0.254: v38.1,31.75 v39.98,31.75 | v11.56,22.48 8.38,25.65 v8.38,27.05
BOTON
  Top 0.254: ESP32-S3-WROOM-1-N8.17 23.49,32 R13.1 R12.2
CE  (via drill 0.35)
  Top 0.254: IC3.4 8.89,17.26 10.16,18.53 v10.16,19.05 | v17.78,37.59 19.16,37.59 ESP32-S3-WROOM-1-N8.11
  Bottom 0.254: v10.16,19.05 10.16,20.32 11.43,21.59 16.76,21.59 17.78,22.61 v17.78,37.59
CHRG
  Top 0.254: D3.C 3.97,17.93 3.98,17.93 4.65,17.26 IC3.9
CS  (via drill 0.35)
  Top 0.254: ESP32-S3-WROOM-1-N8.18 v24.76,30.61 | U3.12 26.62,28.44 v26.46,28.6
  Bottom 0.254: v26.46,28.6 24.76,30.3 v24.76,30.61
D+
  Top 0.254: ESP32-S3-WROOM-1-N8.14 16.91,33.81 J9.1
D-
  Top 0.254: J9.2 19.16,35.05 ESP32-S3-WROOM-1-N8.13
EN1
  Top 0.254: R36.1 R34.1 6.6,21.34 IC3.6
EN2
  Top 0.254: IC3.5 7.1,21.07 R33.1 R35.1
FT-DTR
  Top 0.254: J14.6 12.47,25.08 U5.2 5.08,25.08 | 2.54,27.05 C1.2 | 5.08,25.08 3.75,25.08 R3.2 | 5.08,25.08 3.11,27.05 2.54,27.05 | R1.1 1.95,30.77 1.95,27.65 2.54,27.05
FT-RTS
  Top 0.254: J14.2 12.46,29.02 U6.2 4.28,29.02 R2.1
FT-RX
  Top 0.254: R6.1 12.65,25.91 J14.5
FT-TX
  Top 0.254: R7.1 13.85,27.06 J14.4
GND  (via drill 0.35)  (6 unrouted)
  Top 0.152: ESP32-S3-WROOM-1-N8.40 37.02,50.65 38.1,50.65 v38.1,50.35
  Top 0.254: IC4.2 v6.48,42.29 | C9.2 19.03,18.03 v20.19,18.03 | R29.2 6.1,11.45 v5.82,11.17 | C14.2 v28.19,13.46 | U3.9 29.46,30.35 29.72,30.61 v29.97,30.35 | IC3.8 5.6,19.18 v4.57,19.18 | C7.2 v13.84,39.62 | CR1.1 v12.95,45.21
  Bottom 0.152: v38.1,50.35 18.23,50.35 17.93,50.65 17.78,50.65
  pour Bottom: 0,52.07 46.99,52.07 46.99,0 45.72,-1.27 -1.27,-1.27 -2.54,0 -2.54,49.53
  pour Top: -3.81,52.07 46.99,52.07 46.99,0 45.72,-1.27 -1.27,-1.27 -2.54,0 -2.54,50.8
INPUT_USB  (via drill 0.35)
  Top 0.254: R33.2 R34.2 6.86,23.11 v6.86,23.75 | IC3.13 5.6,13.83 C16.1 4.83,13.34 4.57,13.59 4.19,13.59 3.77,13.17 3.56,12.95 3.56,12.37 4.79,11.14 | IC3.15 6.6,13.85 R39.1 7.37,13.59 7.49,13.72 7.87,13.72 8,13.59 8,10.9 | 5.41,10.52 4.79,11.14 | 5.41,10.52 5.42,10.51 6.75,10.51 | 6.76,10.52 6.75,10.51 | 5.45,10.51 5.41,10.51 5.41,10.52 | 4.79,11.14 4.79,9.91 J4.A4 4.69,9.81 4.69,9.42 4.51,9.24 J4.B9 | 7.03,10.51 7.62,10.51 8,10.9 | 7.03,10.51 6.75,10.51 | 7.03,10.51 7.26,10.28 J4.A9 7.26,8.83 7.08,8.65 7.08,8.26 J4.B4 | 8,10.9 8.53,11.43 v11.43,11.43
  Bottom 0.254: v11.43,11.43 11.43,16.51 7.62,20.32 7.62,24.13 7.24,24.13 v6.86,23.75
INT_IMU
  Top 0.254: ESP32-S3-WROOM-1-N8.23 31.12,32.01 32.01,31.12 33.78,31.12 34.67,30.23 34.67,27.23 33.83,26.39 30.38,26.39 U3.4
LED_RGB
  Top 0.254: D2.4 40.02,50.6 39.37,50.6 38.2,49.43 38.07,49.3 37.95,49.17 36.82,49.17 ESP32-S3-WROOM-1-N8.39 36.94,49.3
MISO  (via drill 0.35)
  Top 0.254: ESP32-S3-WROOM-1-N8.21 28.57,30.73 28.32,30.48 v27.96,30.48 | U3.1 27.84,26.18 v27.3,26.18
  Bottom 0.254: v27.96,30.48 27.3,29.82 v27.3,26.18
MOSI
  Top 0.254: U3.14 27.94,27.44 27.44,27.44 25.9,27.44 25.4,27.94 25.4,29.72 26.04,30.35 ESP32-S3-WROOM-1-N8.19
MUX
  Top 0.254: IC2.1 25.26,16.75 25.53,17.02 26.16,17.02 26.8,16.38 | 26.8,13.21 26.8,16.38 | 26.8,13.21 R26.1 | IC1.1 29.6,7.63 29.34,7.37 28.96,7.37 28.32,8 28.32,12.19 27.3,13.21 26.8,13.21 | 26.8,16.38 26.84,16.38 27.48,17.02 27.48,22.48 28.37,23.37 34.8,23.37 42.23,30.8 42.23,36.99 41.12,38.1 37.17,38.1 ESP32-S3-WROOM-1-N8.30
N$1
  Top 0.254: U5.1 4.35,26.99 R2.2
N$2
  Top 0.254: U6.1 3.24,30.92 R1.2
N$3
  Top 0.254: IC2.16 25.26,7.89 25.53,7.62 26.29,7.62 26.8,8.13 C15.1
N$4
  Top 0.254: IC2.3 23.96,18.34 J10.3
N$5
  Top 0.254: D1.A 16.33,48.32 R5.1
N$6
  Top 0.254: IC2.2 J10.4
N$7
  Top 0.254: U4.1 1.91,42.16 2.41,42.67 3.68,42.67 4.06,42.29 | 4.06,42.29 C22.1 | IC4.3 5.53,42.42 | 5.53,42.42 5.53,42.48 5.59,42.55 4.32,42.55 4.06,42.29 | IC4.1 7.43,42.36 | C21.1 8.42,42.36 7.43,42.36 | 7.43,42.36 6.84,42.95 6.06,42.95 5.53,42.42
N$8
  Top 0.254: R13.2 23.21,29.24 S2.2
N$9
  Top 0.254: IC2.5 22.66,16.41 22.58,16.49 22.58,17.04 22.61,17.07 J10.2
N$10
  Top 0.254: U7.2 17.41,8.14 16.76,7.49 R20.1
N$11
  Top 0.254: IC2.6 22.01,17.79 22,17.8 22,18.3 J10.1
N$12
  Top 0.254: R14.2 U7.3
N$13
  Top 0.254: R15.2 U7.8
N$14
  Top 0.254: IC2.11 22.01,5.79 J11.3
N$15
  Top 0.254: IC2.14 24.11,8.85 24.11,7.13 24.36,6.88 J11.1
N$16
  Top 0.254: U8.2 37.46,15.48 R24.1
N$17
  Top 0.254: 23.33,5.47 J11.2 23.36,8.95 IC2.13
N$18
  Top 0.254: R16.2 36.96,16 U8.3
N$19
  Top 0.254: 37.03,6.42 R17.2 U8.8
N$20
  Top 0.254: IC2.10 J11.4
N$21
  Top 0.254: C19.1 4.85,37.34 7.11,37.34 | 7.11,37.34 7.43,37.65 IC4.5 | C20.1 8.49,37.34 | 8.49,37.34 7.11,37.34 | 8.49,37.34 8.51,37.34 10.25,39.08 10.25,44.08 F1.1
N$22
  Top 0.254: IC3.12 4.15,15.76 3.34,14.94 R28.1
N$23
  Top 0.254: IC1.16 29.6,15.99 29.21,16.38 28.73,16.38 C14.1
N$24
  Top 0.254: IC1.5 32.2,5.77 J1.2
N$25
  Top 0.254: IC1.6 32.87,8.98 J1.1
N$26
  Top 0.254: J2.1 30.51,18.55 30.51,18.05 30.9,17.67 IC1.14
N$27
  Top 0.254: IC1.11 32.85,18.22 J2.3
N$28
  Top 0.254: R29.1 IC3.14
N$29
  Top 0.254: 31,5.57 J1.3 30.89,5.46 30.89,7.51 30.9,7.53 IC1.3 30.84,8.94
N$30
  Top 0.254: IC1.2 30.25,5.82 J1.4
N$31
  Top 0.254: IC1.13 31.47,14.96 31.47,18.53 J2.2
N$32
  Top 0.254: J2.4 IC1.10
N$33
  Top 0.254: R30.1 7.94,14.29 7.18,14.29 7.11,14.35 7.11,15.05 IC3.16
N$34
  Top 0.254: D3.A 2.54,20.26 R31.2
N$35
  Top 0.254: R32.2 3.81,20.32 4.63,20.32 D4.A
N$36
  Top 0.254: S3.2 2.54,49.53 2.54,45.72 2.97,45.29 F1.2
N$37
  Top 0.254: U7.1 16.91,8.65 16.76,8.51 16.26,8.51 15.49,9.27 R21.1
N$38
  Top 0.254: U8.1 37.96,15.1 38.1,15.24 39.12,15.24 39.5,14.86 R25.1
NIVEL_BAT  (via drill 0.35)
  Top 0.254: R38.2 3.97,32.38 R37.1 5.21,33.15 6.6,34.54 10.16,34.54 12.09,36.47 v12.09,38.61 | ESP32-S3-WROOM-1-N8.4 18.06,46.51 18.03,46.48 18.03,39.12 17.76,38.85 14.73,38.85 v14.49,38.6
  Bottom 0.254: v12.09,38.61 14.48,38.61 v14.49,38.6
RESET  (via drill 0.35)
  Top 0.152: ESP32-S3-WROOM-1-N8.3 v18.31,47.78
  Top 0.254: C1.1 3.96,29.97 U6.3 7.95,29.97 8.26,30.28 8.26,32.26 | C2.1 7.87,32.64 8.26,32.26 | 8.26,32.26 8.26,32.38 10.01,34.14 12.23,34.14 12.91,34.82 12.91,43.39 13.97,44.45 15.24,44.45 | 15.24,44.45 15.11,44.58 C3.1 | 16.38,44.58 16.26,44.45 15.75,44.45 | 16.38,44.58 16.51,44.45 17.4,45.34 17.4,46.54 18.31,47.46 v18.31,47.78 | 15.75,44.45 15.24,44.45 | S4.1 15.75,43.53 15.75,43.69 | 15.75,44.45 15.75,43.69 | C7.1 13.84,43.05 14.48,43.69 15.75,43.69 | R4.1 16.38,44.58
  Bottom 0.152: v18.31,47.78 18.8,48.26 v38.1,48.26
SCK
  Top 0.254: ESP32-S3-WROOM-1-N8.20 27.3,30.73 25.81,29.24 25.81,28.32 26.19,27.94 U3.13
SCL1  (via drill 0.35)  (1 unrouted)
  Top 0.254: 16.91,14.72 v14.99,16.64 | v13.36,17.15 13.36,20.22 17.02,23.88 34.67,23.88 41.82,31.03 41.82,36.41 R9.1 40.66,36.35 ESP32-S3-WROOM-1-N8.29
  Bottom 0.254: v14.99,16.64 13.87,16.64 v13.36,17.15
SCL2  (via drill 0.35)
  Top 0.152: 37.81,25.69 36.7,24.58 v36.7,23.62
  Top 0.254: 39.75,7.28 v38.62,8.41 37.96,9.08 U8.10 | ESP32-S3-WROOM-1-N8.31 40.16,38.89 R11.1 42.63,38.65 42.63,30.51 37.81,25.69 37.69,25.57 37.69,21.3 40.66,18.33 40.66,18.26 v41.15,17.78
  Bottom 0.254: v41.15,17.78 41.27,17.78 41.27,9.65 40.01,9.65 38.77,8.41 v38.62,8.41
SDA1  (via drill 0.35)
  Top 0.254: U7.9 17.41,15.36 v16.51,16.26 | v12.7,16.51 12.7,20.32 16.66,24.28 34.5,24.28 41.27,31.05 R8.1 40.62,34.9 36.87,34.9 ESP32-S3-WROOM-1-N8.28
  Bottom 0.254: v16.51,16.26 16,15.75 13.46,15.75 v12.7,16.51
SDA2  (via drill 0.35)
  Top 0.254: U8.9 37.53,9.64 37.53,8.3 v38.48,7.34 | v41.91,19.05 40.64,19.05 38.18,21.51 38.18,25.48 43.04,30.34 43.04,39.51 41.91,40.64 | 41.91,40.64 39.37,43.18 39.37,46.99 38.76,47.6 37.83,47.6 37.65,47.78 ESP32-S3-WROOM-1-N8.38 | R10.1 42.04,40.64 41.91,40.64
  Bottom 0.254: v38.48,7.34 40.03,8.89 41.91,8.89 v41.91,19.05
STDBY
  Top 0.254: D4.C 6.1,20 IC3.7
UART-RX  (via drill 0.35)
  Top 0.254: 15.01,27.15 R7.2 15.37,27.18 17.02,25.53 33.98,25.53 38.82,30.37 v38.82,32.64 | ESP32-S3-WROOM-1-N8.36 38.63,45.24 v38.67,45.27
  Bottom 0.254: v38.67,45.27 38.67,34.83 39.73,33.77 39.73,33.55 v38.82,32.64
UART-TX  (via drill 0.35)
  Top 0.254: 36.72,46.48 ESP32-S3-WROOM-1-N8.37 37.95,46.51 v37.97,46.48 | v38.7,33.87 39.47,33.1 39.47,32.17 39.32,32.02 39.32,30.3 34.14,25.12 15.77,25.12 R6.2
  Bottom 0.254: v37.97,46.48 37.97,34.6 v38.7,33.87
VFROM_CONTROL
  Top 0.254: R32.1 3.81,23.37 3.3,23.37 R31.1 2.54,23.11 | IC3.11 4.15,16.26 3.9,16.51 | 3.9,16.51 4.15,16.76 IC3.10 | 3.9,16.51 3.9,16.55 3.81,16.63 3.81,17.53 3.71,17.53 C18.1 1.65,18.77 1.65,23.11 | 1.65,23.11 1.91,23.37 2.29,23.37 2.54,23.11 | 2.56,23.14 2.54,23.11 | U4.2 1.91,32.64 R38.1 1.91,32.38 1.27,31.75 1.27,23.49 1.65,23.11